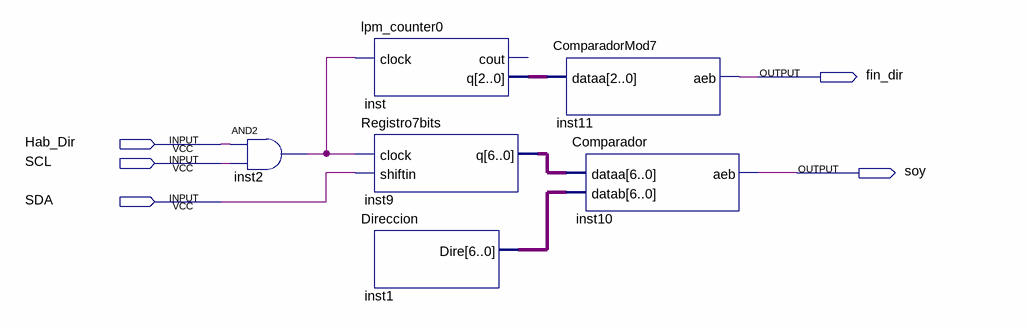
[diagram p0: schematic sheet]
// Quartus schematic seronoser.bdf as structural Verilog: 6 symbols, 5 pins
module seronoser (
  input  Hab_Dir,
  input  SCL,
  input  SDA,
  output fin_dir,
  output soy
);

  wire inst2_out;
  wire [2:0] inst_q;
  wire [6:0] inst1_dire, inst9_q;

  and inst2 (inst2_out, Hab_Dir, SCL);
  lpm_counter0 inst (.clock(inst2_out), .q(inst_q));  // open: cout
  Registro7bits inst9 (.clock(inst2_out), .shiftin(SDA), .q(inst9_q));
  Direccion inst1 (.Dire(inst1_dire));
  ComparadorMod7 inst11 (.dataa(inst_q), .aeb(fin_dir));
  Comparador inst10 (.dataa(inst9_q), .datab(inst1_dire), .aeb(soy));
endmodule
